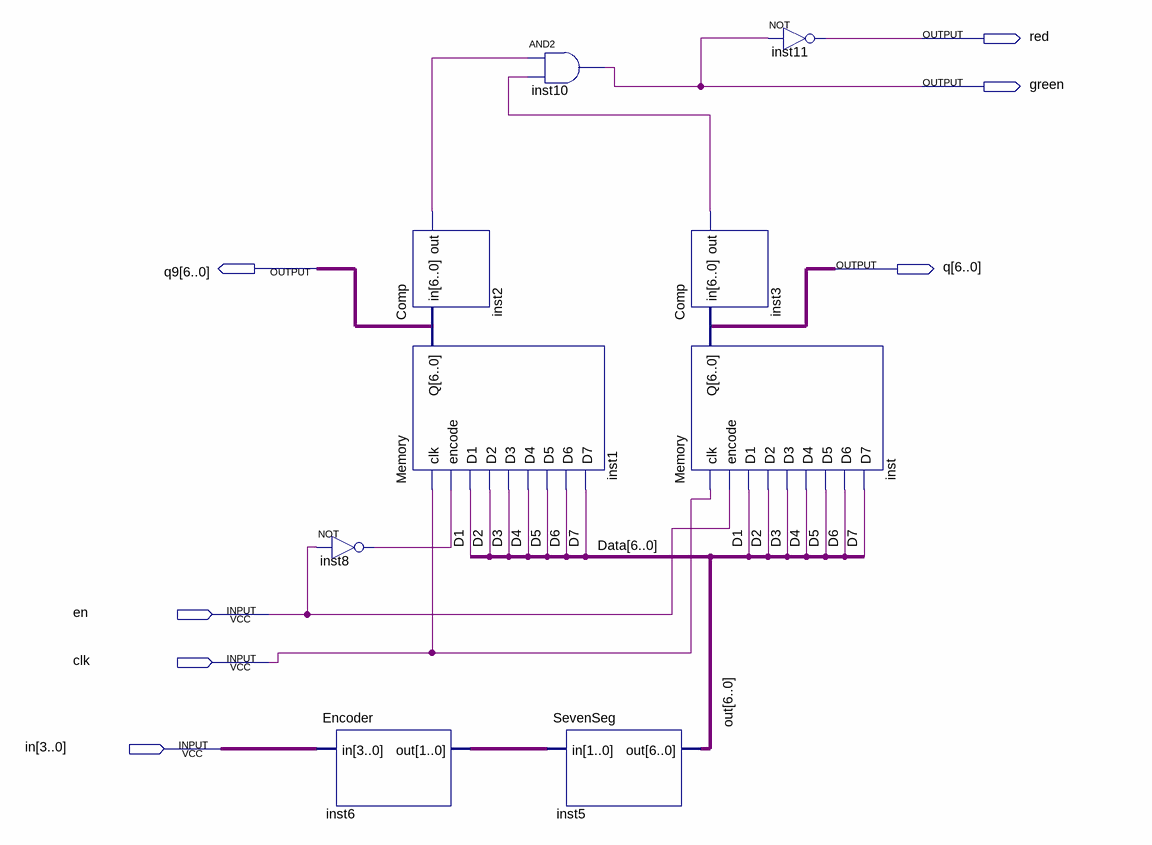
[diagram p0: schematic sheet]
// Quartus schematic lab9pre.bdf as structural Verilog: 9 symbols, 7 pins
module lab9pre (
  input  en,
  input  clk,
  input  [3:0] in,
  output red,
  output green,
  output [6:0] q9,
  output [6:0] q
);

  wire D1, D2, D3, D4, D5, D6, D7, inst2_out, inst3_out, inst8_out;
  wire [1:0] inst6_out;
  wire [6:0] out;

  not inst8 (inst8_out, en);
  Encoder inst6 (.in(in), .out(inst6_out));
  Comp inst2 (.in(q9), .out(inst2_out));
  Memory inst1 (.clk(clk), .encode(inst8_out), .D1(D1), .D2(D2), .D3(D3), .D4(D4), .D5(D5), .D6(D6), .D7(D7), .Q(q9));
  and inst10 (green, inst2_out, inst3_out);
  SevenSeg inst5 (.in(inst6_out), .out(out));
  Comp inst3 (.in(q), .out(inst3_out));
  Memory inst (.clk(clk), .encode(en), .D1(D1), .D2(D2), .D3(D3), .D4(D4), .D5(D5), .D6(D6), .D7(D7), .Q(q));
  not inst11 (red, green);
endmodule
